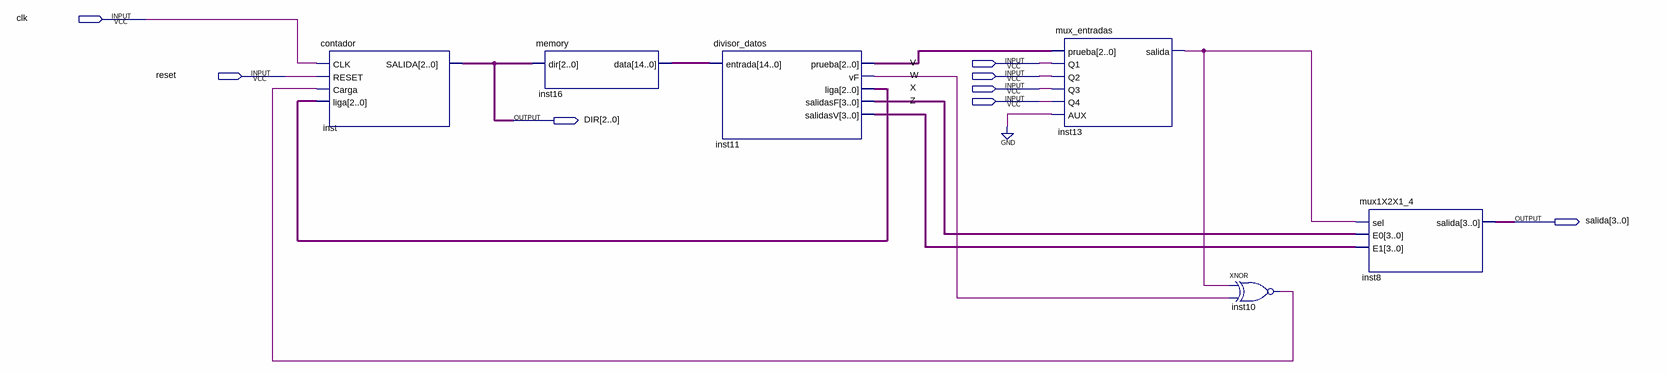
[diagram p0: schematic sheet]
// Quartus schematic Practica5.bdf as structural Verilog: 6 symbols, 8 pins
module Practica5 (
  input  clk,
  input  V,
  input  reset,
  input  W,
  input  X,
  input  Z,
  output [2:0] DIR,
  output [3:0] salida
);

  wire inst10_out, inst11_vf, inst13_salida;
  wire [2:0] inst11_liga, inst11_prueba;
  wire [3:0] inst11_salidasf, inst11_salidasv;
  wire [14:0] inst16_data;

  contador inst (.CLK(clk), .RESET(reset), .Carga(inst10_out), .liga(inst11_liga), .SALIDA(DIR));
  memory inst16 (.dir(DIR), .data(inst16_data));
  divisor_datos inst11 (
    .entrada(inst16_data), .prueba(inst11_prueba), .vF(inst11_vf), .liga(inst11_liga),
    .salidasF(inst11_salidasf), .salidasV(inst11_salidasv));
  mux_entradas inst13 (.prueba(inst11_prueba), .Q1(V), .Q2(W), .Q3(X), .Q4(Z), .AUX(1'b0), .salida(inst13_salida));
  xnor inst10 (inst10_out, inst13_salida, inst11_vf);
  mux1X2X1_4 inst8 (.sel(inst13_salida), .E0(inst11_salidasf), .E1(inst11_salidasv), .salida(salida));
endmodule
